# Altium project DueShieldL2.PrjPCB
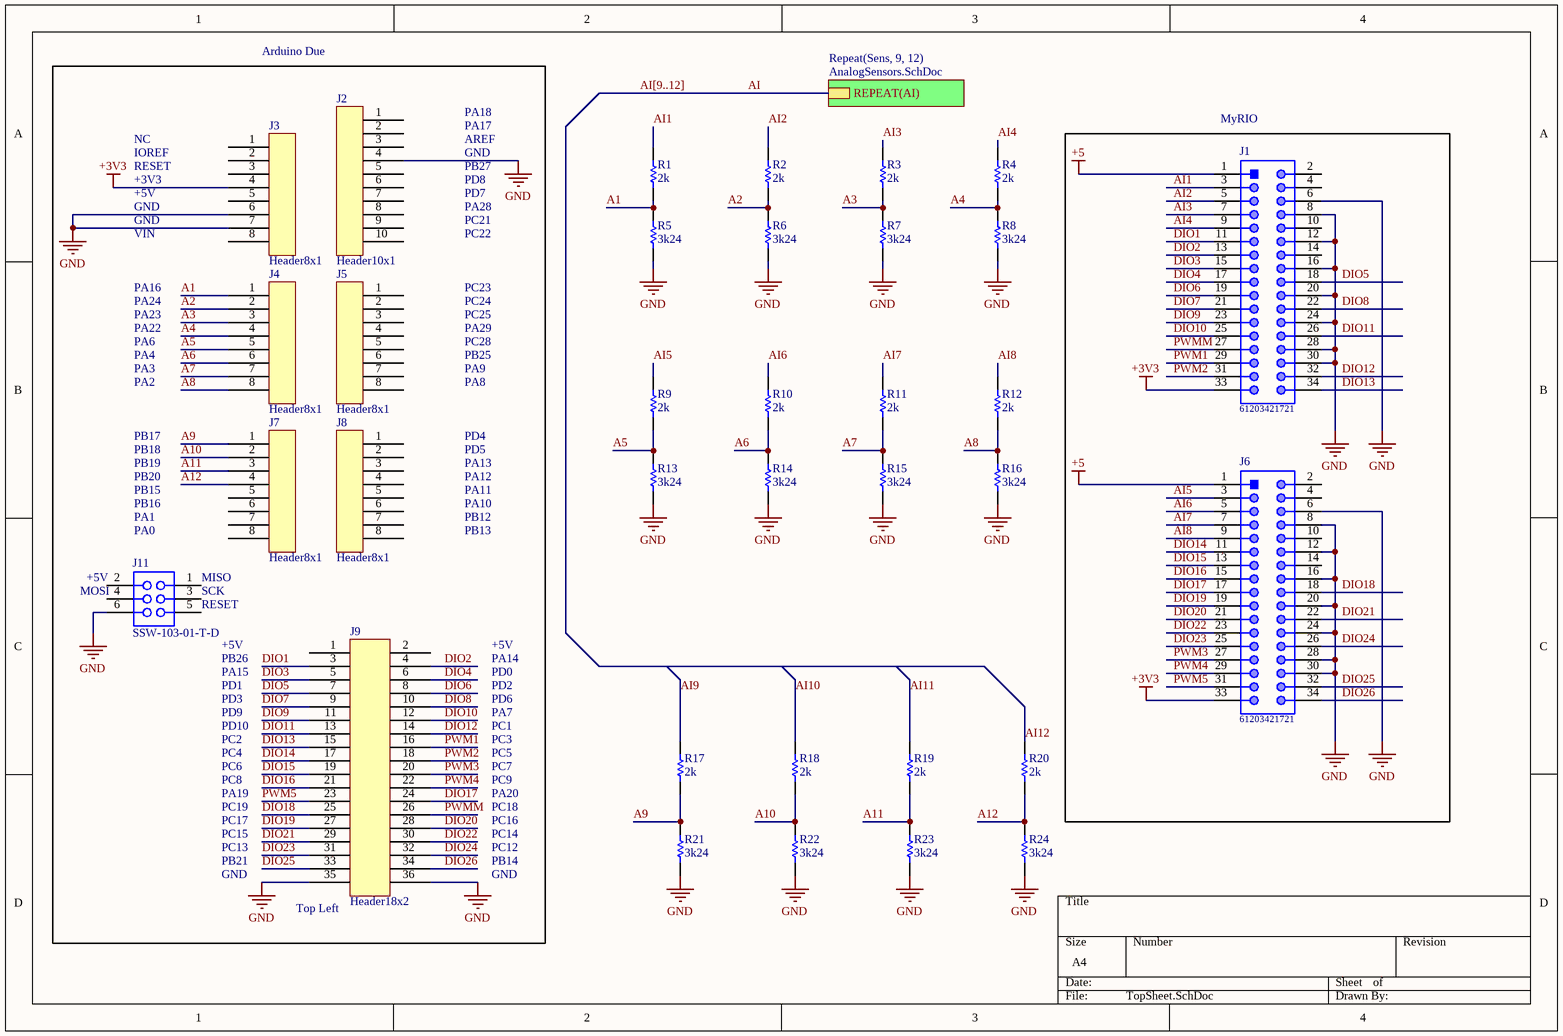
[diagram p0: TopSheet.SchDoc]
2 sheets, 42 parts. Net scope: hierarchical (ports join the sheet entries above them; power ports are global).
Board file: DueShieldL2.PcbDoc
Sheets:
  TopSheet.SchDoc
    Sens9 = AnalogSensors.SchDoc
    Sens10 = AnalogSensors.SchDoc
    Sens11 = AnalogSensors.SchDoc
    Sens12 = AnalogSensors.SchDoc

## Sheet TopSheet.SchDoc
size A4

### Parts
J1  61203421721  [61203421721]
J2  Header10x1  [Header10x1]
J3  Header8x1  [Header8x1]
J4  Header8x1  [Header8x1]
J5  Header8x1  [Header8x1]
J6  61203421721  [61203421721]
J7  Header8x1  [Header8x1]
J8  Header8x1  [Header8x1]
J9  Header18x2  [Header18x2]
J11  SSW-103-01-T-D  [SMTC-SSW-103-01-X-D]
R1  2k  [RESC1608X55X25LL10T15]
R2  2k  [RESC1608X55X25LL10T15]
R3  2k  [RESC1608X55X25LL10T15]
R4  2k  [RESC1608X55X25LL10T15]
R5  3k24  [RESC1608X55X25LL10T15]
R6  3k24  [RESC1608X55X25LL10T15]
R7  3k24  [RESC1608X55X25LL10T15]
R8  3k24  [RESC1608X55X25LL10T15]
R9  2k  [RESC1608X55X25LL10T15]
R10  2k  [RESC1608X55X25LL10T15]
R11  2k  [RESC1608X55X25LL10T15]
R12  2k  [RESC1608X55X25LL10T15]
R13  3k24  [RESC1608X55X25LL10T15]
R14  3k24  [RESC1608X55X25LL10T15]
R15  3k24  [RESC1608X55X25LL10T15]
R16  3k24  [RESC1608X55X25LL10T15]
R17  2k  [RESC1608X55X25LL10T15]
R18  2k  [RESC1608X55X25LL10T15]
R19  2k  [RESC1608X55X25LL10T15]
R20  2k  [RESC1608X55X25LL10T15]
R21  3k24  [RESC1608X55X25LL10T15]
R22  3k24  [RESC1608X55X25LL10T15]
R23  3k24  [RESC1608X55X25LL10T15]
R24  3k24  [RESC1608X55X25LL10T15]

### Blocks framed on the sheet
MyRIO: J1 J6

### Sub-sheets
Repeat(Sens, 9, 12) = AnalogSensors.SchDoc: REPEAT(AI)

### Nets
+3V3: J1.33 J3.4 J6.33
+5: J1.1 J6.1
GND: J1.6 J1.8 J1.12 J1.16 J1.20 J1.24 J1.28 J1.30 J2.4 J3.6 J3.7 J6.6 J6.8 J6.12 J6.16 J6.20 J6.24 J6.28 J6.30 J9.35 J9.36 J11.6 R5.1 R6.1 R7.1 R8.1 R13.1 R14.1 R15.1 R16.1 R21.1 R22.1 R23.1 R24.1
A1: J4.1 R1.1 R5.2
A2: J4.2 R2.1 R6.2
A3: J4.3 R3.1 R7.2
A4: J4.4 R4.1 R8.2
A5: J4.5 R9.1 R13.2
A6: J4.6 R10.1 R14.2
A7: J4.7 R11.1 R15.2
A8: J4.8 R12.1 R16.2
A9: J7.1 R17.1 R21.2
A10: J7.2 R18.1 R22.2
A11: J7.3 R19.1 R23.2
A12: J7.4 R20.1 R24.2
AI: sheet Repeat(Sens, 9, 12)/REPEAT(AI)
AI1: J1.3 R1.2
AI2: J1.5 R2.2
AI3: J1.7 R3.2
AI4: J1.9 R4.2
AI5: J6.3 R9.2
AI6: J6.5 R10.2
AI7: J6.7 R11.2
AI8: J6.9 R12.2
AI9: R17.2
AI10: R18.2
AI11: R19.2
AI12: R20.2
DIO1: J1.11 J9.3
DIO2: J1.13 J9.4
DIO3: J1.15 J9.5
DIO4: J1.17 J9.6
DIO5: J1.18 J9.7
DIO6: J1.19 J9.8
DIO7: J1.21 J9.9
DIO8: J1.22 J9.10
DIO9: J1.23 J9.11
DIO10: J1.25 J9.12
DIO11: J1.26 J9.13
DIO12: J1.32 J9.14
DIO13: J1.34 J9.15
DIO14: J6.11 J9.17
DIO15: J6.13 J9.19
DIO16: J6.15 J9.21
DIO17: J6.17 J9.24
DIO18: J6.18 J9.25
DIO19: J6.19 J9.27
DIO20: J6.21 J9.28
DIO21: J6.22 J9.29
DIO22: J6.23 J9.30
DIO23: J6.25 J9.31
DIO24: J6.26 J9.32
DIO25: J6.32 J9.33
DIO26: J6.34 J9.34
PWM1: J1.29 J9.16
PWM2: J1.31 J9.18
PWM3: J6.27 J9.20
PWM4: J6.29 J9.22
PWM5: J6.31 J9.23
PWMM: J1.27 J9.26

Not connected (* = marked no-connect by the designer): J1 2 4 10 14; J2 1 2 3 5 6 7 8 9 10; J3 1 2 3 5 8; J5 1 2 3 4 5 6 7 8; J6 2 4 10 14; J7 5 6 7 8; J8 1 2 3 4 5 6 7 8; J9 1 2; J11 1(5) 2(6) 3 4 5(1)

### Buses and harness runs
bus AI[9..12]

### Notes on the sheet
- Arduino Due
- PA18
- NC
- IOREF
- RESET
- GND
- PB27
- PA17
- AREF
- +3V3
- +5V
- VIN
- PD8
- PD7
- PA28
- PC21
- PC22
- PA16
- PA24
- PC23
- PC24
- PA23
- PA22
- PA6
- PA4
- PA3
- PA2
- PC25
- PA29
- PC28
- PB25
- PA9
- PA8
- PB17
- PD4
- PB18
- PB19
- PB20
- PB15
- PB16
- PA1
- PD5
- PA13
- PA12
- PA11
- PA10
- PB12
- (near J11) +5V
- (near J11) PA0
- (near J11) MISO
- PB13
- (near J11) MOSI
- (near J11) SCK
- (near J11) RESET
- PB26
- PA15
- PD1
- PD3
- PD9
- PA14
- PD0
- PD2
- PD6
- PA7
- PD10
- PC2
- PC4
- PC6
- PC8
- PC1
- PC3
- PC5
- PC7
- PC9
- PA19
- PC19
- PC17
- PC15
- PC13
- PA20
- PC18
- PC16
- PC14
- PC12
- PB21
- (near J9) Top Left
- PB14

### Library data of the parts
J1 J6 = CMP-1502-00027-1: Male Box Header WR-BHD, THT, Angled, pitch 2.54 mm, 34 pins; Manufacturer: Wurth Elektronik; Pin Number: 34; Working Voltage: 250VAC; Withstanding Voltage: 500VAC; Contact Resistance: 20mOhm; Pitch: 2.54mm; Published Date: August2018; Datasheet URL: https://katalog.we-online.de/em/datasheet/6120xx21721.pdf; Packaging: Tray; Mounting Technology: THT; Publisher: WurthElektronik; Orientation: Angled; Gender: Male; Manufacturer URL: http://www.we-online.de; Part Number: 61203421721; Operating Temperature: -40to125degC; Package Reference: 61203421721
J11 = CMP-1023-00332-1: SQ Post Socket, Through-hole, Vertical, -55 to 105 degC, 2.54 mm Pitch, 6-Pin, Female, RoHS; Manufacturer: Samtec; Pitch: 2.54 mm; PackageDescription: Assembly, Socket Strip .016 X .031 Tail; ComponentLink1URL: http://www.samtec.com; DatasheetVersion: F-214; Orientation: Vertical; ComponentLink2URL: http://www.samtec.com/documents/webfiles/pdf/SSW_TH.PDF; PackageVersion: CA, 6/1987; ComponentLink2Description: Datasheet; PartNumber: SSW-103-01-T-D; ComponentLink3URL: http://www.samtec.com/documents/webfiles/cpdf/SSW-1XX-XX-XXX-X-XX-XXX-XX-MKT.pdf; ComponentLink3Description: Package Specification; Temperature Range: -55 to 105 degC; Mounting Technology: Through-hole; RoHS: True; ComponentLink1Description: Manufacturer URL; PackageReference: SSW-103-01-X-D
R1-R4 R9-R12 R17-R20 = CMP-2000-06937-1: Chip Resistor, 2 KOhm, +/- 1%, 50 V, -55 to 155 degC, 0603 (1608 Metric), RoHS, Tape and Reel; Manufacturer: Yageo; PCN Other: RC/AC0603/0805/120622/Jan/2013; Catalog Drawings: ThickFilmResistorTopThickFilmResistorSide; Kits: PHH4-KIT-ND-RESKIT1K-9.76K1/10W5700PCS; EDA / CAD Models: DownloadfromAcceleratedDesigns; HTML Datasheet: RCSeries,LSuffixDatasheet.html; Power (Watts): 0.1W,1/10W; Other Names: 311-2.00KHRCT; Temperature Coefficient: ±100ppm/°C; Online Catalog: RC0603Series; Features: MoistureResistant; Height: 0.022"(0.55mm); Size / Dimension: 0.063"Lx0.031"W(1.60mmx0.80mm); Resistance (Ohms): 2k; Product Training Modules: ChipResistor; Mounting Technology: SurfaceMount; Package / Case: 0603(1608Metric); Supplier Device Package: 0603; Category: Resistors; Tolerance: ±1%; Packaging: CutTape(CT); Operating Temperature: -55°C~155°C; Standard Package: 1; Series: RC; Datasheet URL: http://www.yageo.com/documents/recent/PYu-RC_Group_51_RoHS_L_7.pdf; Package Description: 2-Pin Surface Mount Device, Body 1.6 x 0.8 mm; Number of Terminations: 2; Datasheet Version: Rev. 7, 05/2017; Package Reference: 0603; Composition: ThickFilm; Manufacturer URL: http://www.yageo.com/; Family: ChipResistor-SurfaceMount
R5-R8 R13-R16 R21-R24 = CMP-2000-06937-1: Chip Resistor, 3K24Ohm, +/- 1%, 50 V, -55 to 155 degC, 0603 (1608 Metric), RoHS, Tape and Reel NOTE: This part has been picked wrong; Manufacturer: Yageo; PCN Other: RC/AC0603/0805/120622/Jan/2013; Resistance (Ohms): 2k; Catalog Drawings: ThickFilmResistorTopThickFilmResistorSide; Kits: PHH4-KIT-ND-RESKIT1K-9.76K1/10W5700PCS; EDA / CAD Models: DownloadfromAcceleratedDesigns; HTML Datasheet: RCSeries,LSuffixDatasheet.html; Power (Watts): 0.1W,1/10W; Other Names: 311-2.00KHRCT; Temperature Coefficient: ±100ppm/°C; Online Catalog: RC0603Series; Features: MoistureResistant; Height: 0.022"(0.55mm); Size / Dimension: 0.063"Lx0.031"W(1.60mmx0.80mm); Product Training Modules: ChipResistor; Mounting Technology: SurfaceMount; Package / Case: 0603(1608Metric); Supplier Device Package: 0603; Category: Resistors; Tolerance: ±1%; Packaging: CutTape(CT); Operating Temperature: -55°C~155°C; Standard Package: 1; Series: RC; Datasheet URL: http://www.yageo.com/documents/recent/PYu-RC_Group_51_RoHS_L_7.pdf; Package Description: 2-Pin Surface Mount Device, Body 1.6 x 0.8 mm; Number of Terminations: 2; Datasheet Version: Rev. 7, 05/2017; Package Reference: 0603; Composition: ThickFilm; Manufacturer URL: http://www.yageo.com/; Family: ChipResistor-SurfaceMount

## Sheet AnalogSensors.SchDoc
size A4
Used 4 times, as channels Sens9, Sens10, Sens11, Sens12. Parts and nets are listed once, with the designators drawn on the sheet.
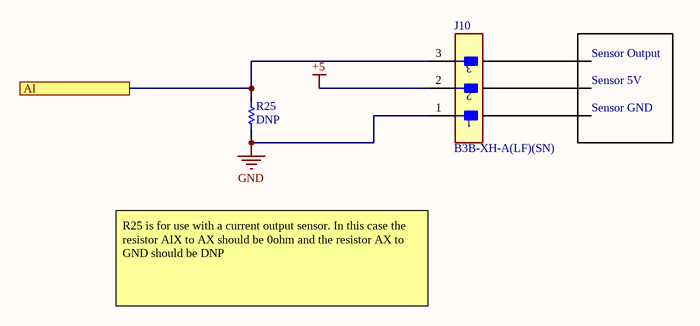
[diagram p1: AnalogSensors.SchDoc]

### Parts
J10  B3B-XH-A(LF)(SN)  [FP-B3B-XH-A_LF_SN-MFG]
R25  DNP  [RESC0603(1608)_L]

### Ports
AI

### Nets
+5: J10.2
GND: J10.1 R25.2
AI: J10.3 R25.1 ; port AI

### Channels
Sens9: designators end in _Sens4; ports AI=AI9
Sens10: designators end in _Sens3; ports AI=AI10
Sens11: designators end in _Sens2; ports AI=AI11
Sens12: designators end in _Sens1; ports AI=AI12

### Notes on the sheet
- Sensor Output
- Sensor 5V
- Sensor GND
- R25 is for use with a current output sensor. In this case the resistor AIX to AX should be 0ohm and the resistor AX to GND should be DNP

### Library data of the parts
J10 = CMP-17439-000014-1: CONN HEADER VERT 3POS 2.5MM; Manufacturer: JST; Conn Gender: Male; Conn Orientation: Vertical; Voltage Rating: 250V; Number Of Contacts: 3; Current Rating: 3A; Contact Material: Tin,Copper; Temperature Range Low: -25°C; Octopart: https://octopart.com/b3b-xh-a%28lf%29%28sn%29-jst-3990185; Device Class L3: unset; Device Class L1: Connectors; Lead Free: Yes; Temperature: -25°C to +85°C; Manufacturer Part Number: B3B-XH-A(LF)(SN); Package: 0; ComponentLink2Description: Datasheet; Pitch: 2.5mm; RoHS: TRUE; Category: Conn; Automotive: No; Temperature Range High: +85°C; Height: 7mm; Device Class L2: Headers and Wire Housings; Number Of Rows: 1; Digikey Description: CONN HEADER VERT 3POS 2.5MM; ComponentLink2URL: https://www.jst-mfg.com/product/pdf/eng/eXH.pdf
R25 = CMP-1012-00440-1: 249R 0.1W 1% 0603 (1608 Metric)  SMD; Value: 249.00 Ohm; Case-Metric: 1608; Case-EIA: 0603; Technology: SMT; Tolerance: 1 %; Power: 0.1 W

## Nets that join several sheets
+5: TopSheet (J1.1 J6.1), Sens9 (J10_Sens4.2), Sens10 (J10_Sens3.2), Sens11 (J10_Sens2.2), Sens12 (J10_Sens1.2)
GND: TopSheet (34 pins), Sens9 (J10_Sens4.1 R25_Sens4.2), Sens10 (J10_Sens3.1 R25_Sens3.2), Sens11 (J10_Sens2.1 R25_Sens2.2), Sens12 (J10_Sens1.1 R25_Sens1.2)
AI9: TopSheet (R17.2), Sens9 (J10_Sens4.3 R25_Sens4.1)
AI10: TopSheet (R18.2), Sens10 (J10_Sens3.3 R25_Sens3.1)
AI11: TopSheet (R19.2), Sens11 (J10_Sens2.3 R25_Sens2.1)
AI12: TopSheet (R20.2), Sens12 (J10_Sens1.3 R25_Sens1.1)